# EAGLE board Nixie Clock v2 (EAGLE 9.6.2)
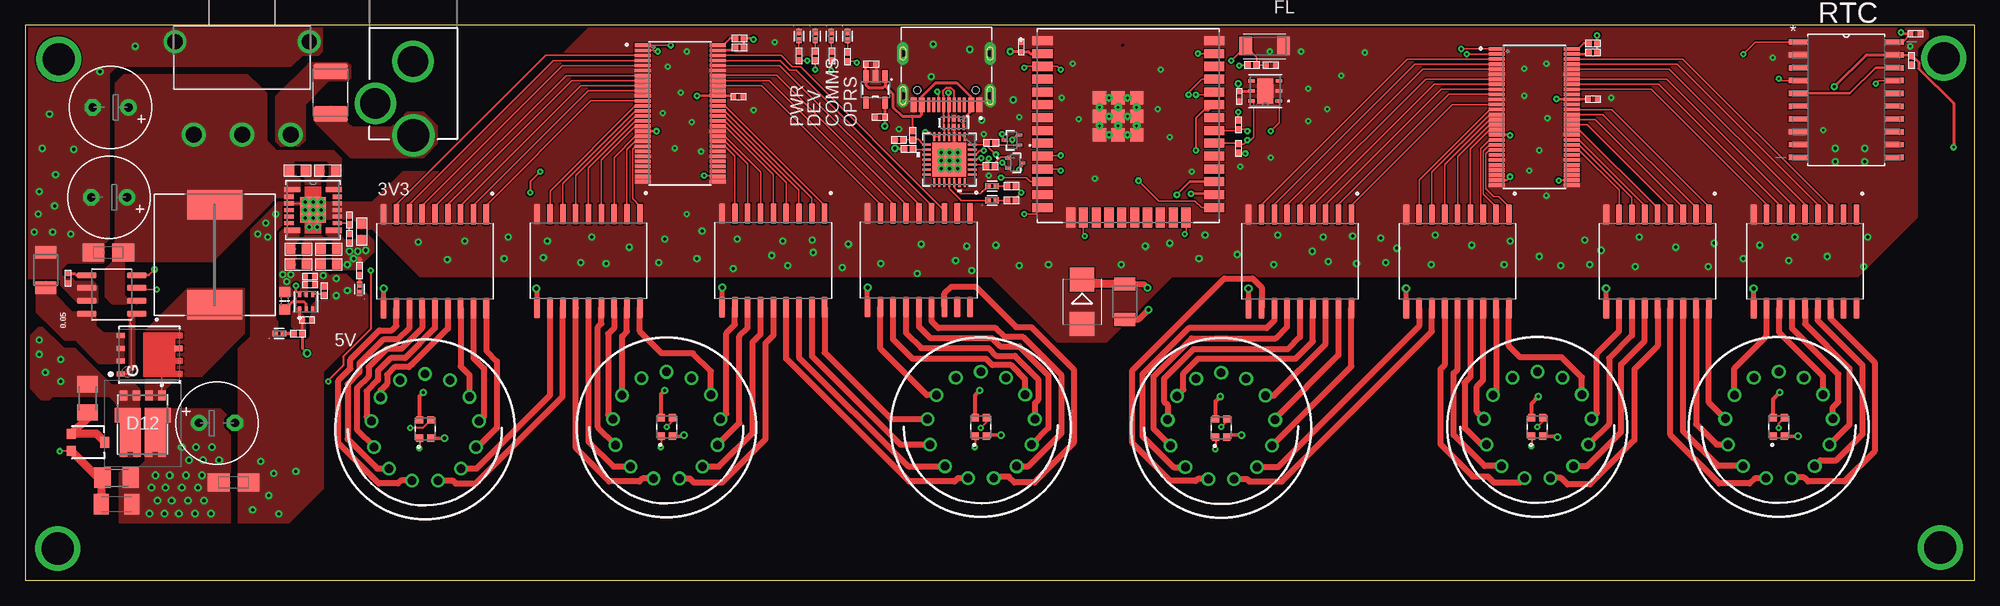
[diagram p2: board, top side]
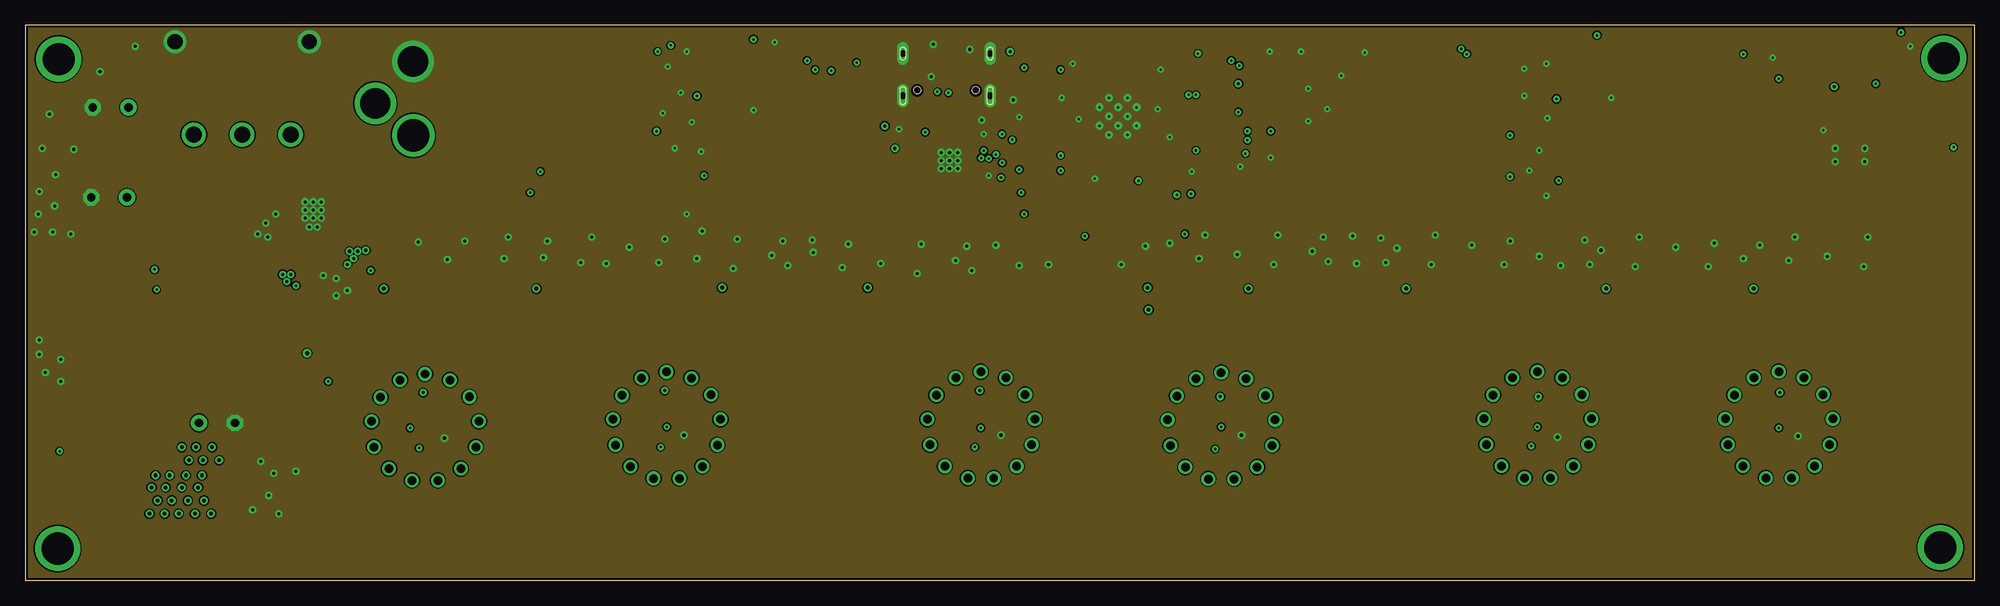
[diagram p3: board, inner layer Route2]
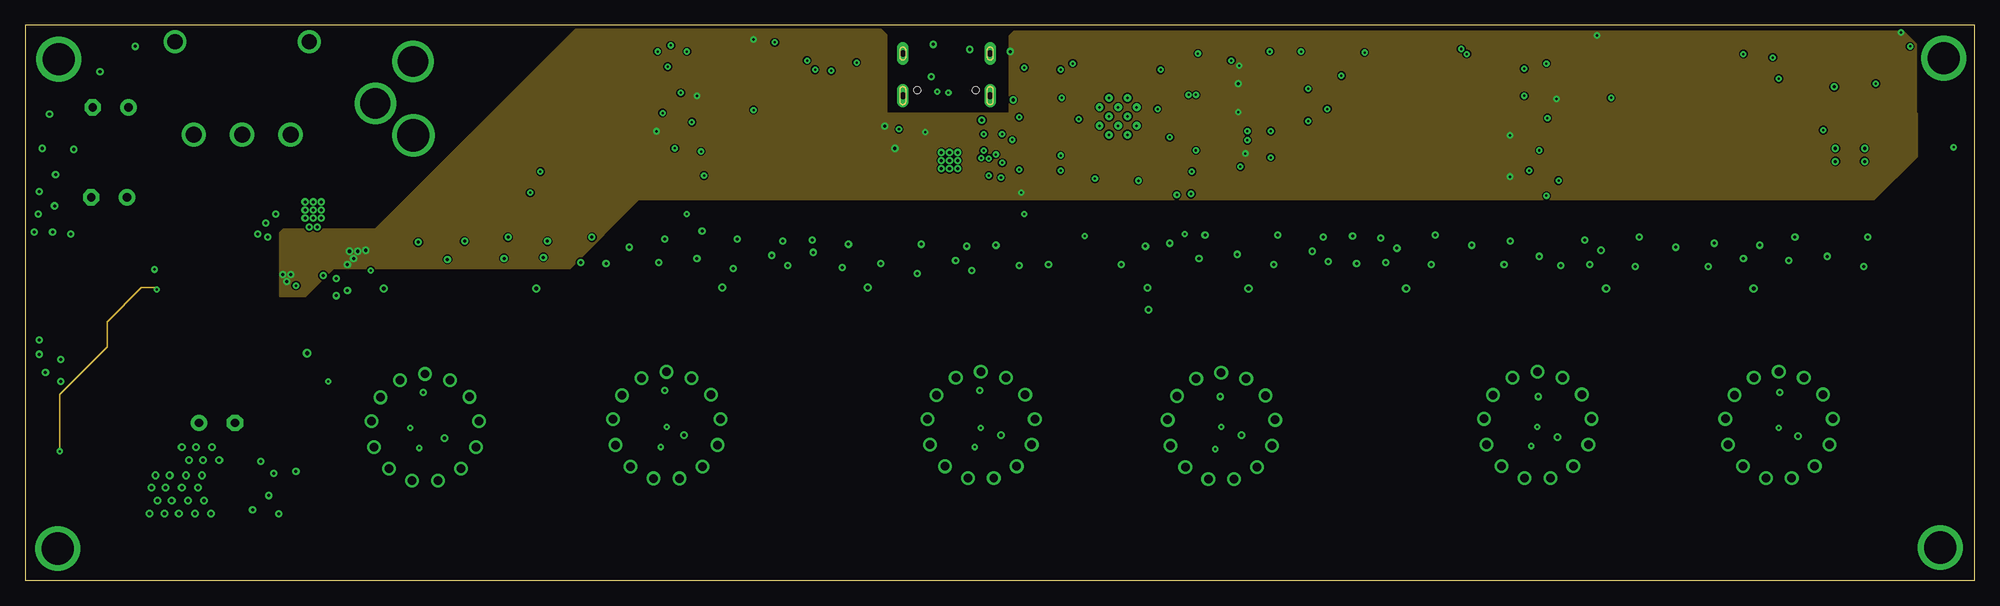
[diagram p4: board, inner layer Route15]
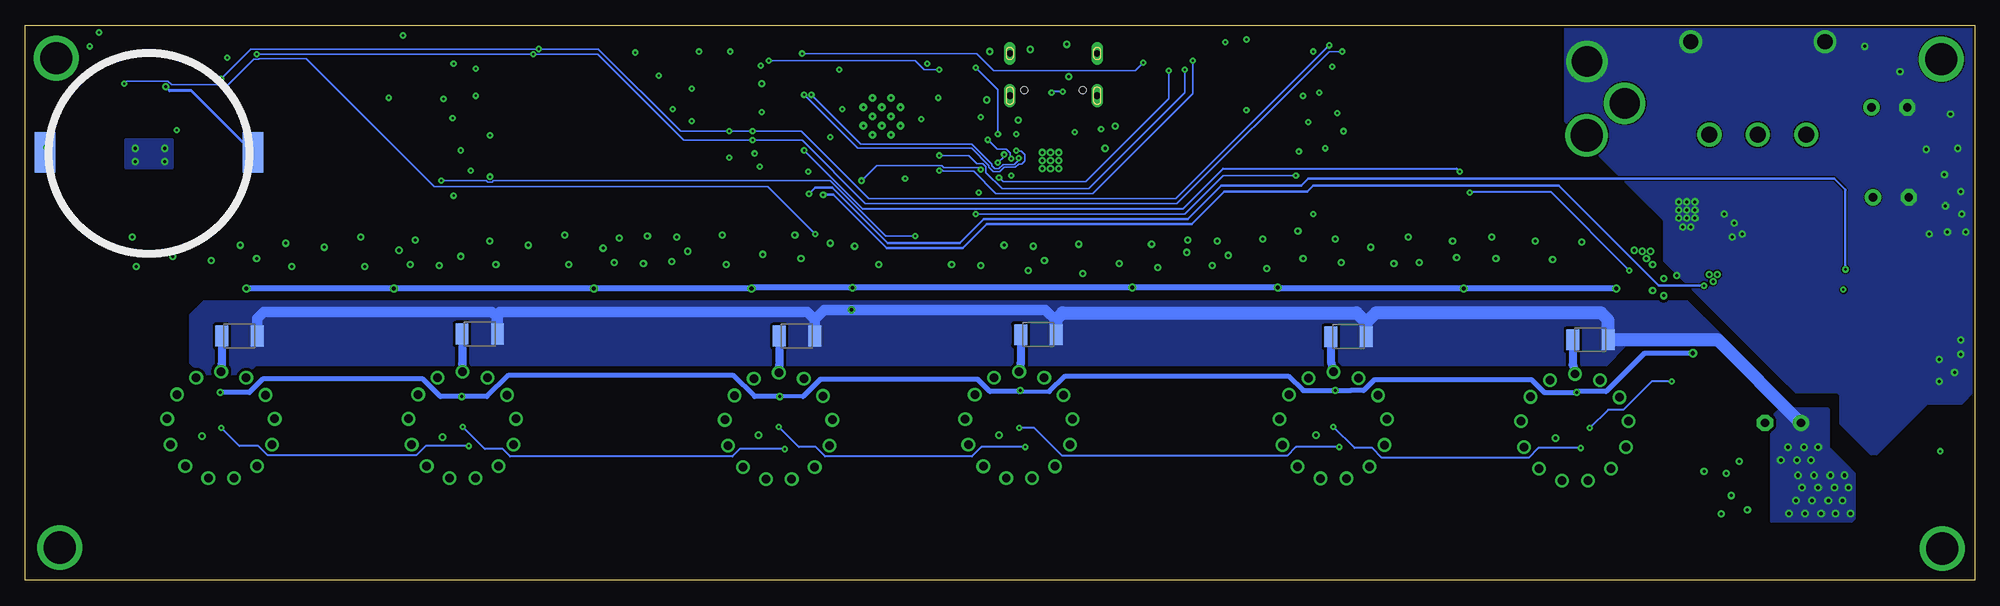
[diagram p5: board, bottom side, seen from below]

Size 193 x 55 mm. Coordinates in mm from the lower left corner, seen from the top.
Outline: 0,0 193,0 193,55 0,55 0,0
Copper layers (1+2*15+16): Top 0.035mm / dielectric 1.11mm / Route2 0.035mm / dielectric 0.15mm / Route15 0.035mm / dielectric 0.2mm / Bottom 0.035mm
Design rules "default *": minimum track width 5mil, minimum drill 0.2mm, track to track 5mil, track to pad 5mil, pad to pad 5mil, via to via 5mil, smd to smd 5mil, copper to edge 10mil, drill to drill 6mil, minimum pad ring 10mil, minimum via ring 8mil, stop-mask expansion 0mil, vias tented up to drill 40mil, thermal gap 0mil
Net classes: 1 HV: width 0.35 mm, drill 0.35 mm, clearance 0.3 mm
tRestrict: 2 lines

## Footprints (pad centres in the part's own frame; a part is rotated, then mirrored left to right if it is on the bottom)
R0402 = smd 0.6 x 0.55: 1 -0.425,0; 2 0.425,0
1210 = smd 1.27 x 2.06: 1 -1.755,0; 2 1.755,0
E3,5-8 = drill 0.813 pad 1.6: + -1.778,0 | drill 0.813 pad 1.6 octagon: - 1.778,0
A/3216-18W = smd 2.15 x 1.8: + 1.475,0; - -1.475,0
C0402 = smd 0.5 x 0.5: 1 -0.475,0; 2 0.475,0
C1206K = smd 1.5 x 2: 1 -1.5,0; 2 1.5,0
C0603R = smd 0.95 x 0.95: 1 -0.85,0; 2 0.75,0
DIODE_SMB = smd 2.4 x 2.4: A 2.2,0; C -2.2,0
LEDC1005X35N = smd 0.59 x 0.61: 1 -0.415,0; 2 0.415,0
VS8DKH02M3H = smd 0.75 x 1: 1 -1.905,-2.905; 2 -0.635,-2.905; 3 0.635,-2.905; 4 1.905,-2.905 | smd 0.75 x 0.56: 5 1.905,2.905; 6 0.575,2.905; 7 -0.575,2.905; 8 -1.905,2.905 | smd 2.08 x 2.88: 9 -1.24,1.195; 10 1.24,1.195 | smd 2.575 x 1.4: 11 1.487,-0.935; 12 -1.487,-0.935
1812 = smd 1.58 x 3.43: 1 -2.1,0; 2 2.1,0
HRO_TYPE-C-31-M-12 = smd 0.6 x 1.45: A1B12 -3.25,5.095; A4B9 -2.45,5.095; B1A12 3.25,5.095; B4A9 2.45,5.095 | smd 0.3 x 1.45: A5 -1.25,5.095; A6 -0.25,5.095; A7 0.25,5.095; A8 1.25,5.095; B5 1.75,5.095; B6 0.75,5.095; B7 -0.75,5.095; B8 -1.75,5.095 | drill 0.65 pad 1.05 long: S1 -4.32,4.18; S2 4.32,4.18; S3 -4.32,0; S4 4.32,0 | hole 0.7: -2.89,3.65; 2.89,3.65
POWER_JACK_PTH_LOCK = drill 2.997 pad 4.115: GND 0.025,6.557; GNDBREAK 3.762,10.7 | drill 3.2 pad 4.115: PWR 0,13.878
WE-PD_1260/1245/1280/1210 = smd 2.9 x 5.4: 1 -4.95,0; 2 4.95,0
L0603 = smd 1 x 1.1: 1 -0.85,0; 2 0.85,0
BEAGLEBONEBLACK_MOUNTING_HOLE = drill 3.175 pad 4.445: P$1 0,0
IN-14 = drill 0.84: 0 4.394,-3.166; 1 -4.394,-3.216; 2 -5.345,-0.796; 3 -5.038,1.745; 4 -3.555,3.883; 5 -1.281,5.06; 6 1.281,5.06; 7 3.555,3.883; 8 5.038,1.745; 9 5.295,-0.796; A 0,-5.49; LHDP 2.477,-4.881; RHDP -2.477,-4.881
INF-PG-TSON-8-2 = smd 0.5 x 0.8: 1 -1.905,2.85; 2 -0.635,2.85; 3 0.635,2.85; 4 1.905,2.85 | smd 0.5 x 0.75: 5 0.635,-2.85
M1206 = smd 1.6 x 2: 1 -1.4,0; 2 1.4,0
RESC4217X170 = smd 1.254 x 1.829: 1 -1.875,0; 2 1.875,0
SS12D11L5 = drill 1.6 pad 2.4: 1 0,0; 2 4.8,0; 3 9.6,0 | drill 1.5 pad 2.25: MH1 -1.85,9.2; MH2 11.45,9.2
SOP50P810X120-56N = smd 1.59 x 0.29: 1 -3.715,6.75; 2 -3.715,6.25; 3 -3.715,5.75; 4 -3.715,5.25; 5 -3.715,4.75; 6 -3.715,4.25; 7 -3.715,3.75; 8 -3.715,3.25; 9 -3.715,2.75; 10 -3.715,2.25; 11 -3.715,1.75; 12 -3.715,1.25; 13 -3.715,0.75; 14 -3.715,0.25; 15 -3.715,-0.25; 16 -3.715,-0.75; 17 -3.715,-1.25; 18 -3.715,-1.75; 19 -3.715,-2.25; 20 -3.715,-2.75; 21 -3.715,-3.25; 22 -3.715,-3.75; 23 -3.715,-4.25; 24 -3.715,-4.75; 25 -3.715,-5.25; 26 -3.715,-5.75; 27 -3.715,-6.25; 28 -3.715,-6.75; 29 3.715,-6.75; 30 3.715,-6.25; 31 3.715,-5.75; 32 3.715,-5.25; 33 3.715,-4.75; 34 3.715,-4.25; 35 3.715,-3.75; 36 3.715,-3.25; 37 3.715,-2.75; 38 3.715,-2.25; 39 3.715,-1.75; 40 3.715,-1.25; 41 3.715,-0.75; 42 3.715,-0.25; 43 3.715,0.25; 44 3.715,0.75; 45 3.715,1.25; 46 3.715,1.75; 47 3.715,2.25; 48 3.715,2.75; 49 3.715,3.25; 50 3.715,3.75; 51 3.715,4.25; 52 3.715,4.75; 53 3.715,5.25; 54 3.715,5.75; 55 3.715,6.25; 56 3.715,6.75
SOT23-5 = smd 0.55 x 1.2: 1 -0.95,-1.3; 2 0,-1.3; 3 0.95,-1.3; 4 0.95,1.3; 5 -0.95,1.3
SOIC127P1030X265-18N = smd 2.06 x 0.6: 1 -4.64,5.08; 2 -4.64,3.81; 3 -4.64,2.54; 4 -4.64,1.27; 5 -4.64,0; 6 -4.64,-1.27; 7 -4.64,-2.54; 8 -4.64,-3.81; 9 -4.64,-5.08; 10 4.64,-5.08; 11 4.64,-3.81; 12 4.64,-2.54; 13 4.64,-1.27; 14 4.64,0; 15 4.64,1.27; 16 4.64,2.54; 17 4.64,3.81; 18 4.64,5.08
PSON65P200X200X80-6N = smd 0.55 x 0.4: 1 -0.75,0.65; 2 -0.75,0; 3 -0.75,-0.65; 4 0.75,-0.65; 5 0.75,0; 6 0.75,0.65
SC-75_ONS-L = smd 0.305 x 0.61: 1 -0.5,-0.699; 2 0.5,-0.699; 3 0,0.699
QFN28_5X5_SIL-L = smd 0.864 x 0.203: 1 -2.273,1.5; 2 -2.273,1; 3 -2.273,0.5; 4 -2.273,0; 5 -2.273,-0.5; 6 -2.273,-1; 7 -2.273,-1.5; 15 2.273,-1.5; 16 2.273,-1; 17 2.273,-0.5; 18 2.273,0; 19 2.273,0.5; 20 2.273,1; 21 2.273,1.5 | smd 0.203 x 0.864: 8 -1.5,-2.273; 9 -1,-2.273; 10 -0.5,-2.273; 11 0,-2.273; 12 0.5,-2.273; 13 1,-2.273; 14 1.5,-2.273; 22 1.5,2.273; 23 1,2.273; 24 0.5,2.273; 25 0,2.273; 26 -0.5,2.273; 27 -1,2.273; 28 -1.5,2.273 | smd 3.353 x 3.353: 29 0,0
DFN6_3X3_SIL-L = smd 0.66 x 0.356: 1 -1.372,0.991; 2 -1.372,0; 3 -1.372,-0.991; 4 1.372,-0.991; 5 1.372,0; 6 1.372,0.991 | smd 1.6 x 2.489: 7 0,0
DQA0010A = smd 0.565 x 0.2: 1 -0.417,1; 2 -0.417,0.5; 4 -0.417,-0.5; 5 -0.417,-1; 6 0.417,-1; 7 0.417,-0.5; 9 0.417,0.5; 10 0.417,1 | smd 0.565 x 0.4: 3 -0.417,0; 8 0.417,0
SOIC127P600X175-8N = smd 1.97 x 0.59: 1 -2.475,1.905; 2 -2.475,0.635; 3 -2.475,-0.635; 4 -2.475,-1.905; 5 2.475,-1.905; 6 2.475,-0.635; 7 2.475,0.635; 8 2.475,1.905
B3QFN15_RDA_TEX = smd 1.6 x 0.508: 1 -2.057,2.025; 7 -2.057,-2.025; 8 2.057,-2.025; 14 2.057,2.025 | smd 0.914 x 0.406: 2 -2.4,1.3; 3 -2.4,0.65; 4 -2.4,0; 5 -2.4,-0.65; 6 -2.4,-1.3; 9 2.4,-1.3; 10 2.4,-0.65; 11 2.4,0; 12 2.4,0.65; 13 2.4,1.3 | smd 2.54 x 2.54: 15 0,0
LED_WS2812C-2020 = smd 0.7 x 0.7: 1 -0.915,0.55; 2 -0.915,-0.55; 3 0.915,-0.55; 4 0.915,0.55
XCVR_ESP32-WROOM-32U = smd 2 x 0.9: 1 -8.5,8.41; 2 -8.5,7.14; 3 -8.5,5.87; 4 -8.5,4.6; 5 -8.5,3.33; 6 -8.5,2.06; 7 -8.5,0.79; 8 -8.5,-0.48; 9 -8.5,-1.75; 10 -8.5,-3.02; 11 -8.5,-4.29; 12 -8.5,-5.56; 13 -8.5,-6.83; 14 -8.5,-8.1; 25 8.5,-8.1; 26 8.5,-6.83; 27 8.5,-5.56; 28 8.5,-4.29; 29 8.5,-3.02; 30 8.5,-1.75; 31 8.5,-0.48; 32 8.5,0.79; 33 8.5,2.06; 34 8.5,3.33; 35 8.5,4.6; 36 8.5,5.87; 37 8.5,7.14; 38 8.5,8.41 | smd 0.9 x 2: 15 -5.715,-9.1; 16 -4.445,-9.1; 17 -3.175,-9.1; 18 -1.905,-9.1; 19 -0.635,-9.1; 20 0.635,-9.1; 21 1.905,-9.1; 22 3.175,-9.1; 23 4.445,-9.1; 24 5.715,-9.1 | smd 1.33 x 1.33: G.1 0.835,2.745; G.2 -1,2.745; G.4 -2.835,2.745; G.5 0.835,0.91; G.6 -1,0.91; G.7 -2.835,0.91; G.8 0.835,-0.925; G.9 -1,-0.925; G.10 -2.835,-0.925 | drill 0.254: G.11 -0.083,2.745; G.12 -1.917,2.745; G.13 0.835,1.827; G.14 -1,1.827; G.15 -2.835,1.827; G.16 -0.083,0.91; G.17 -1.917,0.91; G.18 0.835,-0.007; G.19 -1,-0.007; G.20 -2.835,-0.007; G.21 -0.083,-0.925; G.22 -1.917,-0.925
PCF2129AT = smd 1.803 x 0.533: 1 -4.775,5.715; 2 -4.775,4.445; 3 -4.775,3.175; 4 -4.775,1.905; 5 -4.775,0.635; 6 -4.775,-0.635; 7 -4.775,-1.905; 8 -4.775,-3.175; 9 -4.775,-4.445; 10 -4.775,-5.715; 11 4.775,-5.715; 12 4.775,-4.445; 13 4.775,-3.175; 14 4.775,-1.905; 15 4.775,-0.635; 16 4.775,0.635; 17 4.775,1.905; 18 4.775,3.175; 19 4.775,4.445; 20 4.775,5.715
HOLDER = smd 2 x 4: P$1 10.3,-0.1; P$2 -10.3,-0.1
TRIMPOT-SMD-3MM-CLOSED = smd 1 x 0.9: 1 -0.85,-1.65; 3 0.85,-1.65 | smd 1.1 x 0.9: 2 0,1.65

## Placement (x,y rotation side)
0  inf  [R0402]  29.6,28.7 270 top
0.05  0.05  [1210]  2.04,30.75 270 top
20K  0.05  [1210]  92.7,24.34 0 bottom
20K1  0.05  [1210]  38.05,23.84 0 bottom
20K2  0.05  [1210]  62,24.14 0 bottom
20K3  0.05  [1210]  171.8,24.2 0 bottom
20K4  0.05  [1210]  116.6,24.2 0 bottom
20K5  0.05  [1210]  148,24.4 0 bottom
40K  0.05  [1210]  108.86,27.6 90 top
C1  100u  [E3,5-8]  8.3,37.95 180 top
C2  100u  [E3,5-8]  8.45,46.86 180 top
C3  4.7u  [E3,5-8]  18.98,15.59 0 top
C4  100n  [A/3216-18W]  20.63,9.71 180 top
C5  100n  [C0402]  4.23,29.92 270 top
C6  100n  [A/3216-18W]  8.22,32.49 0 top
C7  100n  [C1206K]  9.03,7.56 180 top
C8  100nF  [C0402]  70.6,47.9 0 top
C11  100nF  [C0402]  155.2,47.68 0 top
C12  22u  [C0603R]  27,40.6 0 top
C13  22u  [C0603R]  29.9,40.6 180 top
C15  22u  [C0603R]  27.1,31.3 0 top
C17  0.1u  [C0402]  28.2,29.3 180 top
C18  10u  [C0402]  28.2,30.1 180 top
C20  10u  [C0402]  27.9,25.8 180 top
C25  100nF  [C0402]  123.31,51.04 0 top
C30  100nF  [C0402]  98.61,52.86 90 top
C31  100nF  [C0402]  120.2,47.95 270 top
C32  100nF  [C0402]  84.6,45.9 180 top
C33  100nF  [C0402]  83.75,51.15 0 top
C34  100nF  [C0402]  187.15,54.15 0 top
C35  22u  [C0603R]  30,31.3 180 top
C36  22u  [C0603R]  27.1,32.8 0 top
C37  22u  [C0603R]  30,32.8 180 top
C39  22u  [C0603R]  33.3,34.6 90 top
D1  [DIODE_SMB]  104.62,27.61 270 top
D2  VLMG1500-GS08  [LEDC1005X35N]  76.6,53.92 90 top
D3  VLMG1500-GS08  [LEDC1005X35N]  78.2,53.92 90 top
D4  VLMG1500-GS08  [LEDC1005X35N]  33.1,28.88 270 top
D5  VLMG1500-GS08  [LEDC1005X35N]  25.15,24.45 180 top
D6  VLMG1500-GS08  [LEDC1005X35N]  79.8,53.92 90 top
D7  VLMG1500-GS08  [LEDC1005X35N]  81.4,53.92 90 top
D10  VLMG1500-GS08  [LEDC1005X35N]  95.73,39.05 180 top
D11  VLMG1500-GS08  [LEDC1005X35N]  95.73,37.65 180 top
D12  VS-8DKH02-M3_H  [VS8DKH02M3H]  11.63,15.43 180 top
F1  MF-MSMF050-2  [1812]  30.23,48.32 90 top
J1  TYPE-C-31-M-12  [HRO_TYPE-C-31-M-12]  91.2,52.2 180 top
J2  POWER_JACKPTH_LOCK  [POWER_JACK_PTH_LOCK]  38.42,57.96 180 top
L1  100u  [WE-PD_1260/1245/1280/1210]  18.76,32.25 270 top
L4  2.2u  [L0603]  25.7,27.7 270 top
MGT1  BEAGLEBONEBLACK_MOUNTING_HOLE  [BEAGLEBONEBLACK_MOUNTING_HOLE]  3.2,3.15 0 top
MGT2  BEAGLEBONEBLACK_MOUNTING_HOLE  [BEAGLEBONEBLACK_MOUNTING_HOLE]  189.6,3.25 0 top
MGT3  BEAGLEBONEBLACK_MOUNTING_HOLE  [BEAGLEBONEBLACK_MOUNTING_HOLE]  3.3,51.65 0 top
MGT4  BEAGLEBONEBLACK_MOUNTING_HOLE  [BEAGLEBONEBLACK_MOUNTING_HOLE]  189.95,51.75 0 top
N1  IN-14  [IN-14]  39.57,14.96 180 top
N2  IN-14  [IN-14]  63.48,15.16 180 top
N3  IN-14  [IN-14]  94.6,15.18 180 top
N4  IN-14  [IN-14]  118.4,15.1 180 top
N5  IN-14  [IN-14]  149.7,15.2 180 top
N6  IN-14  [IN-14]  173.6,15.2 180 top
Q1  IPL60R650P6S  [INF-PG-TSON-8-2]  12.3,22.35 90 top
R1  4.7k  [R0402]  70.7,53.7 0 top
R2  4.7k  [R0402]  120.11,45.13 90 top
R3  4.7k  [R0402]  120.09,42.81 270 top
R4  4.7k  [R0402]  155.2,52.3 180 top
R5  1.5k  [R0402]  78.21,51.96 90 top
R6  1.5k  [R0402]  76.61,51.97 90 top
R7  1.5k  [R0402]  81.41,51.88 90 top
R8  4.7k  [R0402]  155.2,53.2 0 top
R9  10k  [R0402]  95.55,41.04 0 top
R10  1.5k  [R0402]  33.09,30.69 270 top
R11  1.5k  [R0402]  97.63,39.06 180 top
R12  4.7k  [R0402]  70.7,52.8 180 top
R13  1.5k  [R0402]  79.86,51.94 90 top
R14  10k  [R0402]  32.1,33.9 270 top
R15  10k  [R0402]  121.45,51.06 180 top
R16  4.32k  [R0402]  32.1,35.7 90 top
R17  47.5k  [R0402]  86.51,43.64 0 top
R19  10k  [M1206]  6.17,18.04 270 top
R20  10k  [R0402]  95.63,43.34 0 top
R21  22.1k  [R0402]  87.86,44.09 90 top
R22  1k  [R0402]  87.45,42.74 0 top
R23  1.5k  [R0402]  97.64,37.66 180 top
R24  1.5M  [M1206]  9.04,10.17 0 top
R31  1.5k  [R0402]  27,24.45 180 top
R32  0  [R0402]  186.75,51.5 270 top
RESET  SMDSWITCH  [RESC4217X170]  122.7,52.93 180 top
S1  SS-12D11L5  [SS12D11L5]  16.67,44.16 0 top
U1  PCA9698DGG,518  [SOP50P810X120-56N]  64.83,46.26 0 top
U2  PCA9698DGG,518  [SOP50P810X120-56N]  149.4,45.9 0 top
U3  3.3V  [SOT23-5]  84.17,48.63 180 top
U4  ULN2803ADWR  [SOIC127P1030X265-18N]  161.6,31.6 270 top
U5  MAX17223ELT+T  [PSON65P200X200X80-6N]  27.8,27.6 90 top
U6  ULN2803ADWR  [SOIC127P1030X265-18N]  176.2,31.6 270 top
U7  DTC114YET1GSC-75_ONS-L  [SC-75_ONS-L]  98.02,41.35 270 top
U9  CP2102N-A02-GQFN28QFN28_5X5_SIL-L  [QFN28_5X5_SIL-L]  91.49,41.69 270 top
U10  SI7021-A20-GM1RDFN6_3X3_SIL-L  [DFN6_3X3_SIL-L]  122.76,48.48 180 top
U11  DTC114YET1GSC-75_ONS-L  [SC-75_ONS-L]  97.68,43.61 90 top
U12  Value  [DQA0010A]  91.92,45.32 270 top
U13  ULN2803ADWR  [SOIC127P1030X265-18N]  74.06,31.69 270 top
U14  ULN2803ADWR  [SOIC127P1030X265-18N]  88.46,31.73 270 top
U16  ULN2803ADWR  [SOIC127P1030X265-18N]  126.2,31.6 270 top
U17  ULN2803ADWR  [SOIC127P1030X265-18N]  40.56,31.61 270 top
U18  ULN2803ADWR  [SOIC127P1030X265-18N]  55.76,31.65 270 top
U19  ULN2803ADWR  [SOIC127P1030X265-18N]  141.8,31.6 270 top
U20  MAX1771CSA+  [SOIC127P600X175-8N]  8.56,28.33 180 top
U25  TPSM53602RDAR  [B3QFN15_RDA_TEX]  28.5,36.7 0 top
U26  WS2812C-2020  [LED_WS2812C-2020]  39.6,15 90 top
U27  WS2812C-2020  [LED_WS2812C-2020]  63.5,15.2 90 top
U28  ESP32-WROOM-32U  [XCVR_ESP32-WROOM-32U]  109.2,45.05 0 top
U29  WS2812C-2020  [LED_WS2812C-2020]  94.6,15.2 90 top
U30  WS2812C-2020  [LED_WS2812C-2020]  118.4,15.1 90 top
U31  WS2812C-2020  [LED_WS2812C-2020]  149.7,15.2 90 top
U32  WS2812C-2020  [LED_WS2812C-2020]  173.6,15.2 90 top
U$1  [PCF2129AT]  180.28,47.61 0 top
U$2  HOLDER  [HOLDER]  180.75,42.3 180 bottom
VR1  5k  [TRIMPOT-SMD-3MM-CLOSED]  6.22,13.66 270 top

## Tracks (layer width: path | path; a pad name or v marks a point on that pad's centre or on a via)
01
  Top 0.127: U1.8 54.1,49.51 41.83,37.23 U17.4
02
  Top 0.127: U1.20 60.41,43.51 59.57,42.67 U18.2
03
  Top 0.127: U14.8 84.65,37.26 72.9,49.01 U1.48
04
  Top 0.127: U2.8 139.5,49.15 127.47,37.12 U16.4
05
  Top 0.127: U2.20 144.98,43.15 144.35,42.51 144.35,38.25 145.61,36.99 U19.2
5V  (via drill 0.3, 0.4)
  Top 0.254: 27.43,25.5 27.43,24.4 | R31.1 27.43,22.98 v27.9,22.5
  Top 0.305: U5.1 27.15,26.07 C20.2 27.43,25.5 | 27.43,24.4 27.43,22.98
  Top 0.406: U26.4 39.05,18.25 v39.4,18.6 | U27.4 62.95,18.45 v63.3,18.8 | U29.4 94.05,18.35 v94.5,18.8 | U30.4 117.85,17.75 v118.3,18.2 | U31.4 149.15,17.55 v149.8,18.2 | U32.4 173.05,17.95 v173.7,18.6
  Bottom 0.305: v63.3,18.8 61.8,18.8
  Bottom 0.406: v94.5,18.8 94.4,18.7 91.6,18.7 | 116,18.2 v118.3,18.2 | 151.9,18.2 v149.8,18.2 147.3,18.2
  Bottom 0.508: v27.9,22.5 32.7,22.5 36.5,18.7 39.3,18.7 v39.4,18.6 42.6,18.6 43.9,19.9 59.4,19.9 60.5,18.8 61.8,18.8 66.5,18.8 67.9,20.2 90.1,20.2 91.6,18.7 | v94.5,18.8 94.6,18.7 97.5,18.7 98.72,19.92 114.28,19.92 116,18.2 | v118.3,18.2 120.8,18.2 122.9,20.3 145.2,20.3 147.3,18.2 151.9,18.2 153.64,19.94 169.47,19.94 170.81,18.6 v173.7,18.6
  pour Top: 27.7,24.2 27.7,26 27.5,26.2 27.3,26.4 27.3,27 26.9,27 26.5,26.6 26.5,26.5 26.4,26.4 26.4,25.2 26.6,25 26.9,25 27.2,24.7 27.2,24.2
06
  Top 0.127: U6.8 172.39,37.23 160.97,48.65 U2.48
11
  Top 0.127: U1.9 54.98,49.01 43.1,37.13 U17.3
12
  Top 0.127: U1.21 60.41,43.01 60.13,42.73 60.13,37.8 60.84,37.09 U18.1
13
  Top 0.127: U14.7 85.92,37.26 73.66,49.51 U1.49
14
  Top 0.127: U2.9 140.17,48.65 128.74,37.23 U16.3
15
  Top 0.127: 146.39,42.65 U2.21 144.95,42.65 144.6,42.3 144.6,38.8 145.4,38 145.9,38 146.88,37.02 U19.1
16
  Top 0.127: U6.7 173.66,37.23 161.74,49.15 U2.49
21
  Top 0.127: U1.10 55.74,48.51 44.37,37.13 U17.2
22
  Top 0.127: U1.36 69.25,43.01 70.25,42.01 U13.8
23
  Top 0.127: U14.6 87.19,37.26 74.4,50.05 68.58,50.05 U1.50
24
  Top 0.127: U2.10 140.94,48.15 130.01,37.23 U16.2
25
  Top 0.127: U2.36 153.82,42.65 157.79,38.68 U4.8
26
  Top 0.127: U6.6 174.93,37.23 162.5,49.65 U2.50
31
  Top 0.127: U1.12 56,47.51 45.64,37.15 U17.1
32
  Top 0.127: U1.37 69.25,43.51 71.52,41.24 U13.7
33
  Top 0.127: U14.5 88.46,37.26 74.7,51.01 U1.52
34
  Top 0.127: U2.12 141.29,47.15 131.28,37.14 U16.1
35
  Top 0.127: U4.7 159.06,37.91 153.82,43.15 U2.37
36
  Top 0.127: U6.5 176.2,37.23 162.78,50.65 U2.52
41
  Top 0.127: U1.13 60.41,47.01 51.95,38.55 U18.8
42
  Top 0.127: U1.38 69.25,44.01 72.79,40.47 U13.6
43
  Top 0.127: U14.4 89.73,37.16 76.34,50.55 75.7,50.55 74.73,51.51 U1.53
44
  Top 0.127: U2.13 144.98,46.65 137.99,39.66 U19.8
45
  Top 0.127: U2.38 153.82,43.65 160.33,37.14 U4.6
46
  Top 0.127: U6.4 177.47,37.23 163.54,51.15 U2.53
51
  Top 0.127: U1.14 60.41,46.51 53.22,39.32 U18.7
52
  Top 0.127: U1.40 69.25,45.01 74.06,40.2 U13.5
53
  Top 0.127: U14.3 91,36.66 76.76,50.9 75.95,50.9 74.83,52.01 U1.54
54
  Top 0.127: U2.14 144.98,46.15 139.26,40.43 U19.7
55
  Top 0.127: U4.5 161.6,36.87 153.82,44.65 U2.40
56
  Top 0.127: U6.3 178.74,37.02 164.12,51.65 U2.54
61
  Top 0.127: U1.3 51.52,52.01 36.75,37.23 U17.8
62
  Top 0.127: U1.15 60.41,46.01 54.49,40.09 U18.6
63
  Top 0.127: U13.4 75.33,39.43 69.25,45.51 U1.41
64
  Top 0.127: U2.3 136.81,51.65 122.39,37.23 U16.8
65
  Top 0.127: U2.15 144.98,45.65 140.53,41.2 U19.6
66
  Top 0.127: U4.4 162.87,36.92 154.65,45.15 U2.41
71
  Top 0.127: U1.4 52.3,51.51 38.02,37.23 U17.7
72
  Top 0.127: U1.16 60.41,45.51 55.76,40.86 U18.5
73
  Top 0.127: U1.42 69.25,46.01 76.6,38.66 U13.3
74
  Top 0.127: U2.4 137.58,51.15 123.66,37.23 U16.7
75
  Top 0.127: U2.16 144.98,45.15 141.8,41.97 U19.5
76
  Top 0.127: U4.3 164.14,36.92 155.41,45.65 U2.42
81
  Top 0.127: U1.5 53.16,51.01 39.29,37.13 U17.6
82
  Top 0.127: U1.17 60.41,45.01 57.03,41.63 U18.4
83
  Top 0.127: U13.2 77.87,37.89 69.25,46.51 U1.43
84
  Top 0.127: U2.5 138.36,50.65 124.93,37.23 U16.6
85
  Top 0.127: U2.17 144.98,44.65 143.07,42.74 U19.4
86
  Top 0.127: U4.2 165.41,36.92 156.19,46.15 U2.43
91
  Top 0.127: U1.7 53.53,50.01 40.56,37.03 U17.5
92
  Top 0.127: U1.19 60.41,44.01 58.3,41.9 U18.3
93
  Top 0.127: U13.1 79.14,37.12 69.25,47.01 U1.44
94
  Top 0.127: U2.7 138.62,49.65 126.2,37.23 U16.5
95
  Top 0.127: U2.19 144.98,43.65 144.09,42.76 144.09,36.49 U19.3
96
  Top 0.127: U4.1 166.68,37.02 157.06,46.65 U2.44
170V  (via drill 0.35)
  Top 0.61: 40K.1 110.25,25.84 v111.2,26.8
  Bottom 1.016: 20K.2 90.94,25.75 92,26.8 v111.2,26.8 113.9,26.8 114.84,25.86 20K4.2 114.84,25.84 115.6,26.6 146,26.6 146.3,26.3 146.3,24.45 20K5.2 146.25,26.05 146.8,26.6 169.4,26.6 170.04,25.95 20K3.2
  Bottom 1.27: C3.+ 25.45,23.84 20K1.2 36.3,25.8 37,26.5 59.3,26.5 60.24,25.55 | 20K2.2 60.24,25.55 | 60.24,25.55 61.19,26.5 90.3,26.5 90.94,25.86 20K.2
  other vias: 17.5,10.4 15.9,10.4 14.3,10.4 12.9,10.4 18.4,6.6 16.8,6.6 15.2,6.6 13.8,6.6 12.3,6.6 17.7,7.9 16.1,7.9 14.5,7.9 13.1,7.9 17.1,9.2 15.5,9.2 13.9,9.2 12.5,9.2 19.2,11.9 17.6,11.9 16.2,11.9 18.5,13.2 16.9,13.2 15.5,13.2
  pour Top: 11.9,17 19.3,17 20.3,16 20.3,5.7 9.3,5.7 9.3,10.6 9.7,11 11.1,11 11.9,11.8
  pour Bottom: 11.9,6.1 11.9,10.6 14.4,13.1 14.4,16.9 14.6,17.1 19.2,17.1 20.2,16.1 20.2,5.8 12.2,5.8
  pour Bottom: 25.3,24.5 28.5,27.7 40.3,27.7 175.3,27.7 176.7,26.3 176.7,21.6 175.5,20.4 171.1,20.4 170.2,21.3 36.5,21.3 34.6,23.2 25.6,23.2 25,23.8 25,24.2
BOOT  (via drill 0.2, 0.25)
  Top 0.15: U28.25 116.45,36.95 115.8,37.6 112.2,37.6 v110.2,39.6 | v98.4,40.7 98.72,41.02 U7.3
  Bottom 0.15: v110.2,39.6 108.69,41.1 102.29,41.1 102.09,40.9 98.6,40.9 v98.4,40.7
COMLED  (via drill 0.2)
  Top 0.15: R13.1 79.86,50.56 v79.8,50.5 | v96.6,39.9 99.1,39.9 99.51,39.49 U28.12
  Bottom 0.15: v79.8,50.5 79.8,47.7 88,39.5 96.2,39.5 v96.6,39.9
D+  (via drill 0.2)
  Top 0.2: U9.4 91.42,44.03 U12.7 U12.4 91.42,47.08 J1.A6 91.45,48.25 v91.4,48.3 | J1.B6 90.45,48.25 v90.3,48.4
  Bottom 0.2: v90.3,48.4 91.3,48.4 v91.4,48.3
D-
  Top 0.2: U9.5 90.99,44.83 U12.6 U12.5 90.92,47.08 J1.A7 90.95,48 90.87,48.08 90.87,48.52 91.18,48.83 91.62,48.83 91.93,48.52 91.93,47.12 J1.B7
DEVLED  (via drill 0.2)
  Top 0.15: R5.1 v78.21,50.61 v78.2,50.6 | v102.5,42.1 100.77,42.1 U28.10
  Bottom 0.15: v78.2,50.6 78.2,48.3 87.7,38.8 96.3,38.8 97.89,40.4 97.89,41.01 98.19,41.3 98.81,41.3 99.6,42.1 v102.5,42.1
DTR  (via drill 0.2)
  Top 0.15: U9.28 95.06,43.19 R20.1 95.2,43.09 v96.1,42.2 | U7.2 97.25,40.85 v96.72,41.38
  Bottom 0.15: v96.72,41.38 96.1,42 v96.1,42.2
EN5V  (via drill 0.25)
  Top 0.254: U5.6 26.8,28.7 v26.8,29.2 | U28.27 115.29,39.49 v114,38.2
  Bottom 0.254: v26.8,29.2 31.3,29.2 41.2,39.1 65.5,39.1 66.1,38.5 74.3,38.5 77.5,35.3 97.8,35.3 100.2,32.9 107.7,32.9 113,38.2 v114,38.2
GND  (via drill 0.2, 0.3, 0.35)
  Top 0.15: U12.8 91.99,44.83 U9.3 91.99,42.71 v92.3,42.4 | U25.3 27.85,37.35 U25.15 | D12.10 10.39,16.12 D12.11
  Top 0.305: C33.2 84.22,49.98 U3.2
  Top 0.35: U26.2 41.48,14.09 v41.5,14.1 | U27.2 65.09,14.29 v65.2,14.4 | U29.2 95.27,14.4 v96.6,14.4 | U30.2 119.17,14.4 v120.4,14.4 | U31.2 151.62,14.29 v151.7,14.2 | U32.2 175.49,14.29 v175.5,14.3
  other vias: 182.1,41.5 179.2,41.5 179.2,42.8 182.1,42.8 29.3,37.5 28.5,37.5 27.7,37.5 29.3,36.7 28.5,36.7 27.7,36.7 29.3,35.9 28.5,35.9 27.7,35.9 28.9,35 28.1,35 23,34.3 24,34 23.8,35.4 24.8,36.3 47.8,34 41.8,31.8 38.9,33.5 47.4,31.9 51.7,33.6 51.3,32 56.1,34 43.5,33.6 25.1,6.6 30.8,29.9 24.1,8.4 23.3,11.8 30.8,28.2 26.8,10.8 75.5,31.2 75,33.6 24.6,10.6 97.8,47.6 89.9,53.1 89.7,49.9 1.4,38.5 77.9,33.7 93.5,52.6 94.7,45.6 29.5,30.2 57.5,31.4 66.5,31.9 62.7,31.5 67,34.6 55,31.5 59.8,33 63.3,33.8 70.1,30.9 73.9,32.2 1.7,42.8 70.5,33.8 10.9,52.9 31.9,28.7 2.4,46.2 7.4,50.4 2.9,37.1 3,40.2 4.8,42.7 4.5,34.3 1.3,36.3 22.5,7 2.7,34.5 0.9,34.5 108.5,31.3 98.4,31.2 101.3,31.3 178.4,32.1 174.6,31.7 171.7,33.2 175.2,34 182,31.1 110.9,33.1 182.4,34 154.4,33.7 154.9,31.3 152,31.2 163.4,33 167.2,33.4 170.1,31.9 166.6,31.1 159.8,34 156,32.7 159.4,31.1 134.2,33.9 134.7,31.5 131.8,31.4 143.2,33.2 147,33.6 149.9,32.1 146.4,31.3 139.6,34.2 135.8,32.9 139.2,31.3 129,31.6 128.5,34 131.4,34.1 120,32.3 116.2,31.9 113.3,33.4 116.8,34.2 123.6,31.3 127.4,32.6 124,34.2 93.7,30.7 93.2,33.1 96.1,33.2 84.7,31.4 80.9,31 78,32.5 81.5,33.3 88.3,30.4 92.1,31.7 88.7,33.3 128.9,46.7 127,48.7 127,45.5 130.3,50 132.6,52.3 126.3,52.4 157,47.8 113.3,43.9 103.7,51.2 64.3,42.8 65.5,36.3 63.6,50.9 123.3,41.9 65.5,52.4 63.1,46.3 102.6,47.8 178,44.6 123.2,52.4 64.9,48.3 74.2,53.3 66,45.4 66.9,42.5 86.5,44.7 72.1,46.6 94.9,44.2 148.4,48 173,51.8 150.7,45.8 112.1,46.7 148.4,50.7 150.6,51.2 150.6,38.1 186.6,52.9 149.9,42.6 95.4,40.1 115.5,40.5 148.9,40.6 112.4,50.6 105.9,39.8 104.3,45.7 98.4,45.9 120.3,41 91.5,41.6 91.5,40.8 92.3,40.8 92.3,41.6 90.7,42.4 91.5,42.4 90.7,40.8 90.7,41.6 1.4,22.4 1.4,23.8 2,20.6 3.5,21.9 3.5,19.7
  pour Top: 9.4,12.25 9.4,17.15 8.35,18.2 2.65,18.2 2.35,17.9 1.65,17.9 0.55,19 0.55,24.25 0.75,24.45 1.35,25.05 1.7,25.05 3.6,23.15 3.8,22.95 4.9,22.95 8.5,19.35 9.3,19.35 10.9,19.35 11.3,18.95 11.3,12.3 11.25,12.25
  pour Top: 5.25,27.5 3.5,29.25 3.5,29.7 3.3,29.9 0.25,29.9 0.05,30.1 0.05,54.9 0,54.95 5.1,54.95 8.3,51.75 8.3,33.85 7.8,33.35 7.8,31.55 7.7,31.45 4.15,31.45 3.55,30.85 3.55,30.25 3.9,29.9 4.6,29.9 4.9,29.6 6.75,29.6 7.2,29.15 7.2,27.5
  pour Top: 8.05,50 9,50.95 26.3,50.95 27.4,52.05 29,52.05 29.4,52.45 29.4,54.95 5,54.95 4.7,54.65 4.7,52.55 7.25,50
  pour Route2: 0.05,55.05 116.8,55.05 116.8,54.95 193.05,54.95 193.05,0 0.05,0
  pour Top: 27.5,30.9 27.5,33.9 27.7,34.1 27.7,35.5 27.7,36.6 27.2,37.1 27.1,37.2 25.7,37.2 25.7,37.5 27.2,37.5 27.7,38 27.7,39 27.7,39.9 27.4,40.2 27.4,41.1 29.6,41.1 29.6,40.2 29.4,40 29.2,39.8 29.2,38.1 29.8,37.5 29.9,37.5 34.5,37.5 34.7,37.3 34.7,35.3 34.2,34.8 33,34.8 32.8,35 32.8,35.5 32.5,35.8 32.2,35.8 30.3,35.8 29.7,35.8 29.3,35.4 29.3,34.1 29.5,33.9 29.7,33.7 29.7,33.2 29.7,30.9
  pour Top: 28.2,30.9 28.5,30.6 28.5,29.9 28.5,29 29.1,29 29.3,28.8 30.9,28.8 30.9,29.4 29.8,30.5 29.6,30.7 29.6,31 28.3,31
  pour Top: 21.1,5.7 21.1,22.9 22.3,24.1 22.3,34.7 25.1,37.5 25.8,37.5 25.8,37.2 25.5,37.2 25.4,37.1 25.4,35.2 24.8,34.6 24.8,25.8 25,25.6 25,24.4 25.6,23.8 27.9,23.8 28.2,24.1 28.2,26.1 28.3,26.2 28.3,27.2 28.8,27.7 30,27.7 30.2,27.9 30.2,30.1 30.4,30.3 31.8,30.3 33.9,28.2 33.9,25.1 29.5,20.7 29.5,9.1 26.1,5.7
  pour Top: 34.3,37.4 37.4,40.5 41.6,40.5 56,54.9 187.8,54.9 188.4,54.3 188.4,53.8 187.3,52.7 187.3,36 181.4,30.1 113.5,30.1 107,23.6 102.2,23.6 95.7,30.1 39.1,30.1 34.3,34.9
  pour Bottom: 178.4,43.7 183.1,43.7 183.1,40.8 178.4,40.8
  pour Bottom: 9.7,12.5 4.7,17.5 1.3,17.5 0.1,18.7 0.1,54.9 40.6,54.9 40.6,45.5 30.8,35.7 30.8,31.7 17.7,18.6 13.6,18.6 13.3,18.3 13.3,15.5 10.3,12.5
INT_RTC  (via drill 0.2)
  Top 0.15: U28.24 114.92,34.41 v114.8,34.3 | v183.2,49.2 183.51,49.52 U$1.17
  Bottom 0.15: v114.8,34.3 119.5,39 152.5,39 165.2,51.7 169.83,51.7 169.89,51.64 170.36,51.64 172.9,49.1 178.51,49.1 178.87,49.45 182.94,49.45 v183.2,49.2
LEDADDR  (via drill 0.2)
  Top 0.2: U28.33 117.11,46.52 116.61,46.52 115.9,45.81 v115.9,42.6 | v51,40.5 50,39.5 v50,38.4 | U26.3 39.34,15.1 v38.1,15.1 | v30,19.7 30,19.82 31.47,21.29 31.47,22.17 34.2,24.9 v34.2,30.7
  Bottom 0.2: v115.9,42.6 110.13,36.83 78.37,36.83 74.4,40.8 51.3,40.8 v51,40.5 | v50,38.4 49.9,38.5 42,38.5 v34.2,30.7 | v30,19.7 32,19.7 34.8,16.9 36.3,16.9 v38.1,15.1
N$1
  pour Top: 39.4,41.9 32.2,41.9 28.6,45.5 28.6,47 31.9,47 31.9,45.3 32.3,44.9 36.3,44.9 37.8,46.4 39.4,46.4 40.8,45 40.8,43.3
N$2
  Top 0.305: C5.1 4.9,30.39 5.1,30.2 6.05,30.2 U20.5
N$3
  Bottom 0.813: 20K1.1 39.8,21.39 N1.A
N$4
  Top 0.15: Q1.1 10.04,20.45 10.5,20.9 10.5,25.3 10.4,25.4 10.4,25.79 U20.1
  pour Top: 9.15,20.65 9.8,20.65 10.3,21.15 10.3,26.6 10.65,26.25 10.85,26.25 10.85,20.95 10.15,20.25 9.15,20.25
N$5
  pour Top: 9.75,21.5 7.3,21.5 5.1,23.7 5.1,26.6 7,26.6 7,25.2 7.7,24.5 9.75,24.5
  pour Top: 7,26.6 4.6,26.6 3,28.2 3,29.6 1.1,29.6 1.1,26.6 2.9,24.8 3.9,23.8 5.7,23.8 7,25.1
N$6
  Top 0.15: D12.1 13.54,21.37 Q1.5
  pour Top: 11.6,24.4 16.1,28.9 21.7,28.9 21.7,24.5 17.4,20.2 11.6,20.2
  pour Top: 11.9,17.9 11.9,19.9 11.6,20.2 14.4,20.2 15.1,20.2 13.9,19 13.9,18.7 13.9,17.9
N$7
  Top 0.406: 59.6,26.98 U18.17
  Top 0.61: N2.0 59.09,24.19 59.57,24.67 U18.17
N$8
  Top 0.406: 58.2,26.91 U18.16
  Top 0.61: U18.16 58.3,25 57.71,24.41 57.71,16.43 N2.9
N$9
  Bottom 0.813: 20K2.1 63.76,21.62 N2.A
N$10
  Top 0.813: R19.2 6.17,16.11 VR1.1 7.07,14.52 7.87,13.71 VR1.2
N$11  (via drill 0.2)
  Top 0.15: VR1.3 v3.41,12.81 v3.4,12.8 | v13,28.8 11.2,28.8 U20.3
  Top 0.813: VR1.3 7.21,10.17 R24.1 7.53,10.06 C7.2
  Route15 0.15: v3.4,12.8 3.4,18.4 8.1,23.1 8.1,25.6 11.5,29 12.8,29 v13,28.8
N$12
  Top 0.61: N2.8 56.7,15.16 56.7,25.1 57.03,25.43 U18.15
N$13
  Top 0.406: 55.8,26.97 U18.14
  Top 0.61: U18.14 55.76,13.74 58.22,11.28 N2.7
N$14
  Top 0.61: N1.5 42.3,9.9 42.6,9.6 44.6,9.6 53.2,18.2 53.2,26.99 U18.12
N$15
  Bottom 0.813: 20K.1 94.45,21.52 N3.A
N$16
  Top 0.61: N2.6 61.1,10.1 60.8,9.8 57.8,9.8 54.5,13.1 U18.13
N$17
  Top 0.152: U5.4 29.52,28.35 0.2
N$18
  Top 0.15: R5.2 78.2,52.4 D3.1
N$19
  Top 0.15: R7.2 81.41,53.49 D7.1
N$20
  Top 0.305: U5.2 27.8,27.4 27.6,27.6 26.45,27.6 L4.2
N$21
  Bottom 0.813: 20K4.1 118.36,21.34 N4.A
N$22
  Top 0.61: N2.1 67.87,20.73 66.1,22.5 63,22.5 60.84,24.66 U18.18
N$23
  Top 0.15: U9.8 88.91,43.19 88.4,43.7 87.89,43.7 R21.1 86.96,43.66 R17.2
N$24
  Top 0.15: R6.2 76.6,52.41 D2.1
N$25
  Top 0.35: D4.1 33.1,30.25 R10.2
N$26
  Top 0.254: 25.7,24.45 D5.1
  Top 0.35: R31.2 25.7,24.45
N$27
  Top 0.15: R13.2 79.8,52.42 D6.1
N$28
  Top 0.61: N2.2 69.4,16.53 69.4,24.5 70.25,25.35 U13.11
N$29
  Top 0.15: R20.2 96.25,43.14 98.35,43.14 U11.1
N$30
  Top 0.15: R9.2 95.97,41.34 96.58,41.95 97.22,41.95 U7.1
N$32
  Top 0.61: N1.6 37.2,9.9 36.9,9.6 35,9.6 31,13.6 31,19.8 32.18,20.98 32.18,21.88 35.06,24.76 36.3,24.76 36.75,25.21 U17.11
N$33
  Top 0.61: U17.12 38.02,25.02 36.85,23.85 35.43,23.85 33.09,21.5 33.09,20.6 31.91,19.42 31.91,13.99 34.82,11.08 N1.7
N$35
  Top 0.15: U9.9 87.92,42.69 R22.2
N$36
  Top 0.15: D10.1 R11.2
N$37
  Top 0.15: D11.1 97.2,37.65 R23.2
N$38
  pour Top: 24.8,43.5 24.8,47.9 28.2,51.3 31.9,51.3 32.2,51 32.2,49.8 31.9,49.5 30,49.5 27.7,47.2 27.7,43.6 27.1,43 25.3,43
N$39
  Top 0.61: U17.13 39.29,25 37.23,22.94 35.81,22.94 33.99,21.12 33.99,20.22 32.82,19.05 32.82,14.93 N1.8
N$40
  Top 0.61: N1.9 33.8,16.23 33.8,18.74 34.91,19.85 34.91,20.75 36.19,22.03 37.6,22.03 40.56,24.99 U17.14
N$41
  Top 0.61: U17.15 41.83,24.93 38.27,21.37 38.23,21.37 37.98,21.12 36.56,21.12 35.81,20.37 35.81,19.47 35.18,18.83 N1.0
N$42
  Top 0.61: U17.16 43.1,21.2 43.96,20.34 N1.1
N$43
  Top 0.61: U17.17 44.37,22.03 45.4,21 45.4,16.24 N1.2
N$44
  Top 0.61: U17.18 45.64,22.76 46.7,21.7 46.7,15.1 44.81,13.21 N1.3
N$45
  Top 0.61: N2.3 70.7,15.6 70.7,24.2 71.52,25.02 U13.12
N$46
  Top 0.61: N1.4 44.68,11.08 51.95,18.35 U18.11
N$47
  Top 0.61: N2.4 68.68,11.28 72,14.6 72,23.6 72.8,24.4 U13.13
N$48
  Top 0.61: N2.5 65.8,10.1 66.2,9.7 69,9.7 73.3,14 73.3,23.5 74.1,24.3 74.1,27.01 U13.14
N$49
  Top 0.61: N3.6 92.32,10.12 92,9.8 87.5,9.8 75.33,21.97 U13.15
N$50
  Top 0.61: U13.16 76.6,22.1 87.4,11.3 N3.7
N$51
  Top 0.61: N3.8 86.67,13.44 77.9,22.2 77.9,27.02 U13.17
N$52
  Top 0.61: U13.18 79.14,22.56 85.72,15.98 N3.9
N$53
  Top 0.61: N3.0 89.25,18.35 84.65,22.95 U14.11
N$54
  Top 0.61: U14.12 85.92,23.88 87.85,21.95 95.13,21.95 95.74,21.34 97.61,21.34 98.36,20.59 98.36,20.56 98.99,19.92 N3.1
N$55
  Top 0.61: U14.13 87.19,24.51 88.7,23 95.36,23 96.11,22.25 97.98,22.25 99.27,20.97 99.27,20.93 100.27,19.93 100.27,17.87 99.94,17.54 N3.2
N$56
  Top 0.61: U14.14 88.46,25.14 89.6,24 95.7,24 96.51,23.19 98.42,23.19 101.3,20.31 101.3,15.1 N3.3
N$57
  Top 0.61: N3.4 99.31,11.3 100.92,12.9 100.92,12.92 102.6,14.6 102.6,20.3 98.8,24.1 97,24.1 96.1,25 90.4,25 89.73,25.67 U14.15
N$58
  Top 0.61: U14.16 91,28.4 91.7,29.1 94.1,29.1 98.1,25.1 99.6,25.1 103.8,20.9 103.8,13.6 99.9,9.7 97.94,9.7 97.37,10.27 96.03,10.27 N3.5
N$59
  Top 0.254: U2.55 154.62,52.15 R4.2
N$60
  Top 0.61: N4.6 116.08,10.04 115.88,9.84 113.36,9.84 109.6,13.6 109.6,20.8 118.71,29.91 121.52,29.91 122.39,29.04 U16.11
N$61
  Top 0.61: U16.12 123.66,25.76 122.9,25 115.2,25 110.6,20.4 110.6,14.31 113.69,11.22 N4.7
N$62
  Top 0.61: N4.8 111.7,15.02 111.7,20.21 115.47,23.99 123.79,23.99 124.93,25.13 U16.13
N$63
  Top 0.61: U16.14 126.2,24.1 124.98,22.88 115.65,22.88 112.73,19.95 112.73,17.74 113.11,17.36 N4.9
N$64
  Top 0.61: N4.0 114.64,18.91 114.64,20.51 116.1,21.97 125.77,21.97 127.47,23.67 U16.15
N$65
  Top 0.61: N4.1 123.62,18.32 128.74,23.44 U16.16
N$66
  Top 0.61: U16.17 130.01,22.31 123.75,16.05 N4.2
N$67  (via drill 0.35, 0.4)
  Top 0.508: U17.10 35.48,28.88 v35.5,28.9 | U18.10 50.68,28.82 v50.6,28.9 | U13.10 68.98,28.98 v69,29 | U14.10 83.38,28.98 v83.4,29 | U16.10 121.12,28.88 v121.1,28.9 | U19.10 136.72,28.88 v136.7,28.9 | U4.10 156.52,28.88 v156.5,28.9 | U6.10 171.1,26.98 v171.1,28.9
  Top 0.61: 40K.2 110.75,29.36 v111.1,29
  Top 0.813: 40K.2 104.36,29.36 104.3,29.3 104.3,29.49 D1.C
  Bottom 0.61: v35.5,28.9 v50.6,28.9 68.9,28.9 v69,29 v83.4,29 v111.1,29 121,29 v121.1,28.9 v136.7,28.9 v156.5,28.9 v171.1,28.9
N$68
  Top 0.61: N4.3 131.28,21.2 U16.18
N$69
  Top 0.61: U19.11 137.99,25.19 124.02,11.22 N4.4
N$70
  Top 0.61: N4.5 120.96,10.04 121.2,9.8 124.4,9.8 139.26,24.66 U19.12
N$71
  Top 0.61: U19.17 145.61,18.67 N5.0
N$72
  Top 0.61: N5.9 143.7,16.7 143.7,19.2 144.34,19.84 U19.16
N$73
  Top 0.406: 143.1,26.93 U19.15
  Top 0.61: U19.15 143.07,20.17 142.5,19.6 142.5,15.1 144.14,13.46 N5.8
N$74
  Top 0.61: N5.7 144.48,11.32 141.4,14.4 141.4,20.5 141.8,20.9 U19.14
N$75
  Top 0.61: U19.13 140.53,21.33 140.1,20.9 140.1,13.5 143.3,10.3 144.8,10.3 145.4,9.7 147.98,9.7 N5.6
N$76
  Top 0.61: N5.1 154.09,20.11 152.1,22.1 148,22.1 146.88,23.22 U19.18
N$77
  Top 0.61: U4.11 157.8,24.7 155.59,22.49 155.59,16.54 N5.2
N$78
  Top 0.61: U4.12 159.06,24.26 156.8,22 156.8,15.52 N5.3
N$79
  Top 0.61: N5.4 154.62,11.32 158,14.7 158,21.4 160.33,23.73 U4.13
N$80
  Top 0.61: U4.14 161.6,23.2 159.3,20.9 159.3,13.9 154.9,9.5 152.7,9.5 152.06,10.14 N5.5
N$81
  Top 0.61: N6.6 172.28,10.1 171.2,10.1 170.7,9.6 167.7,9.6 162.87,14.43 U4.15
N$82
  Top 0.61: N6.7 167.58,11.32 164.14,14.76 U4.16
N$83
  Top 0.61: U4.17 165.41,15.49 167.44,13.46 N6.8
N$84
  Top 0.61: N6.9 166.68,17.62 U4.18
N$85
  Top 0.61: N6.0 169.21,21.01 172.39,24.19 U6.11
N$86
  Top 0.61: N6.1 177.99,20.21 173.66,24.54 U6.12
N$87
  Top 0.61: N6.2 178.94,17.14 179.5,17.7 179.5,20.4 174.93,24.97 U6.13
N$88
  Top 0.61: U6.14 176.2,25.4 180.6,21 180.6,15.42 N6.3
N$89
  Top 0.61: N6.4 177.74,11.9 179.3,11.9 181.9,14.5 181.9,21.31 177.47,25.74 U6.15
N$90
  Top 0.61: U6.16 178.74,25.96 183.1,21.6 183.1,12.8 180.1,9.8 176.5,9.8 176.1,10.2 174.94,10.2 N6.5
N$91
  Top 0.15: U25.9 31.98,35.4 R16.1 R14.1
N$92
  Bottom 0.813: 20K5.1 149.75,21.45 N5.A
N$93
  Bottom 0.813: 20K3.1 173.56,21.43 N6.A
N$94
  Top 0.254: U1.56 69.11,53.01 69.8,53.7 R1.1
N$95
  Top 0.254: U1.55 69.98,52.51 R12.2
N$96  (via drill 0.2, 0.3)
  Top 0.254: U$1.19 186.62,52.05 R32.1
  Top 0.305: U$1.19 182.25,52.05 v179.1,48.9 | R32.1 187.02,51.65 187.14,51.65 187.45,51.35 187.45,50.71 190.9,47.26 v190.9,42.9
  Bottom 0.305: U$2.P$2 176.55,48.5 178.7,48.5 v179.1,48.9 | U$2.P$1 190.9,42.55 v190.9,42.9
N$97
  Top 0.254: U2.56 153.75,52.65 154.3,53.2 R8.1
N$100  (via drill 0.2)
  Top 0.2: U26.1 39.05,13.15 v39,13.1 | U27.3 64.05,15.75 v63.5,15.2
  Bottom 0.2: v39,13.1 43.2,13.1 44.16,12.14 58.69,12.14 59.65,13.1 61.4,13.1 v63.5,15.2
N$101  (via drill 0.2)
  Top 0.2: U27.1 62.95,13.25 v62.9,13.2 | v94.6,15.1 95.15,15.65 U29.3
  Bottom 0.2: v62.9,13.2 67.21,13.2 68.07,12.34 90.34,12.34 93.1,15.1 v94.6,15.1
N$102  (via drill 0.2)
  Top 0.2: U29.1 94.05,13.25 v94,13.2 | v118.4,15.2 118.95,15.75 U30.3
  Bottom 0.2: v118.4,15.2 116.4,13.2 114.73,13.2 113.81,12.28 99.27,12.28 98.35,13.2 v94,13.2
N$103  (via drill 0.2)
  Top 0.2: U30.1 117.85,13.05 v117.8,13 | v149.7,15.2 150.25,15.75 U31.3
  Bottom 0.2: v149.7,15.2 147.5,13 145.73,13 145.01,12.28 122.99,12.28 122.27,13 v117.8,13
N$104  (via drill 0.2)
  Top 0.2: U31.1 149.15,13.35 v149.1,13.3 | v173.6,15.1 173.6,15.56 U32.3
  Bottom 0.2: v173.6,15.1 171.8,13.3 169.93,13.3 169.01,12.38 154.29,12.38 153.37,13.3 v149.1,13.3
N$199
  Top 0.254: U$1.18 183.19,50.78 180.65,48.24 U$1.5
NEN170V  (via drill 0.25)
  Top 0.254: U20.4 12.23,30.23 v12.8,30.8 | v115.4,38.3 117.62,38.3 U28.26
  Bottom 0.254: v12.8,30.8 12.8,38.7 13.9,39.8 66,39.8 66.7,39.1 74.6,39.1 77.9,35.8 98.1,35.8 100.5,33.4 107.59,33.4 113.09,38.9 114.8,38.9 v115.4,38.3
OE0  (via drill 0.2)
  Top 0.15: U28.14 100.05,36.3 v98.9,36.3 | v67.2,40.1 68.45,40.1 U1.30
  Bottom 0.15: v98.9,36.3 78.2,36.3 74.4,40.1 v67.2,40.1
OE1  (via drill 0.2)
  Top 0.15: U2.30 151.85,39.65 v151.8,39.6 | v104.9,34.1 104.75,34.24 U28.16
  Bottom 0.15: v104.9,34.1 107.83,34.1 113.33,39.6 146.65,39.6 146.78,39.47 147.22,39.47 147.35,39.6 v151.8,39.6
OPRLED  (via drill 0.2)
  Top 0.15: R7.1 82.15,51.45 v82.3,51.3 | v116.1,52.2 U28.37
  Bottom 0.15: v82.3,51.3 83.1,50.5 97.1,50.5 98.8,52.2 v116.1,52.2
PWRLED  (via drill 0.2)
  Top 0.15: R6.1 76.66,51.5 v77.4,51.5 | v102.5,40.6 102.34,40.76 U28.11
  Bottom 0.15: v77.4,51.5 77.4,48.2 87.3,38.3 96.9,38.3 99.12,40.52 102.11,40.52 102.29,40.7 102.4,40.7 v102.5,40.6
RST  (via drill 0.2)
  Top 0.15: U11.3 96.7,43.89 v96.7,44.2 | v98.9,50.8 99.02,50.92 100.3,50.92 U28.3 102.18,50.92 v102.5,50.6 | C25.1 121.9,51.04 | 121.9,51.04 121.89,51.04 R15.1 | 121.9,51.04 121.9,51.85 RESET.2 v119.4,51.51 v119.4,51.5
  Bottom 0.15: v96.7,44.2 96.7,48.6 v98.9,50.8 | v119.4,51.5 104.9,51.5 104,50.6 v102.5,50.6
RTS  (via drill 0.2)
  Top 0.15: U9.24 94.97,41.19 R9.1 95.12,41.52 v95.4,41.8 | U11.2 98.18,44.11 v97.72,43.65
  Bottom 0.15: v97.72,43.65 96.78,42.7 95.89,42.7 95.5,42.31 95.5,41.9 v95.4,41.8
RXD  (via drill 0.2)
  Top 0.15: U9.26 94.08,42.19 94.47,42.58 v94.9,42.58 | v115.9,48.1 117.42,48.1 U28.34
  Bottom 0.15: v94.9,42.58 94.84,42.53 94.41,42.53 94.05,42.16 94.05,41.54 94.34,41.24 94.66,41.24 94.98,40.92 96.07,40.92 96.5,40.49 97.15,40.49 97.61,40.95 97.61,41.11 99.29,42.8 110.6,42.8 v115.9,48.1
RXD_LED
  Top 0.15: U9.18 91.49,38.81 92.65,37.65 D11.2
SCL  (via drill 0.2)
  Top 0.15: U28.30 120.03,43.3 R3.1 120.64,43.23 v121,43.6 121.3,43.6 121.6,43.9 121.6,47.28 U10.6 | v142.7,52.14 U2.2 | v62.6,52.4 62.3,52.4 62.19,52.51 U1.2 | U$1.1 171.28,53.33 v170.1,52.14
  Bottom 0.15: v62.6,52.4 63.93,52.4 79,37.33 109.83,37.33 116.1,43.6 v121,43.6 127.8,43.6 136.34,52.14 v142.7,52.14 v170.1,52.14
SDA  (via drill 0.2)
  Top 0.15: U28.31 119.97,44.57 R2.1 120.8,44.7 v121,44.5 | U2.1 v142.17,52.65 | U1.1 v63.89,53.01 v63.9,53 | v173.6,49.7 173.78,49.52 U$1.4 | U10.1 124.13,45.33 v123.3,44.5
  Bottom 0.15: v63.9,53 79.1,37.8 109.5,37.8 116.2,44.5 v121,44.5 v123.3,44.5 128.1,44.5 136.25,52.65 v142.17,52.65 170.65,52.65 v173.6,49.7
TXD  (via drill 0.2)
  Top 0.15: U9.25 94.19,41.69 94.35,41.85 v94.65,41.85 | U28.35 116.45,49.65 115.17,48.37 v115.17,48.1
  Bottom 0.15: v115.17,48.1 110.27,43.2 99.3,43.2 97.33,41.23 97.33,41.07 97.03,40.77 96.61,40.77 96.19,41.2 95.1,41.2 94.65,41.65 v94.65,41.85
TXD_LED
  Top 0.15: D10.2 94.56,38.3 92.6,38.3 91.99,38.91 U9.19
VBUS
  Top 0.2: R21.2 87.86,45.94 87.8,46
  Top 0.305: U3.1 85.12,48.98 | 85.12,48.98 85.9,48.2 85.9,46.9 86.8,46 87.8,46 88.6,46 88.75,46.15 J1.B4A9 88.75,47.92 90.13,49.3 92.2,49.3 93.65,47.85 J1.A4B9 93.65,46.47 U12.1 U12.10 | C33.1 83.22,51.09 U3.3 83.22,49.08 83.5,48.8 84.94,48.8 85.12,48.98
VCC
  pour Top: 11.9,27.4 8.6,27.4 7.9,28.1 7.9,30.8 8.2,31.1 8.7,31.6 8.7,31.8 8.8,31.9 9.8,31.9 9.8,28.2 10.1,27.9 11.9,27.9
  pour Top: 8.7,31.6 8.7,33.3 8.9,33.5 8.9,49.2 9.8,50.1 22,50.1 23.3,48.8 23.9,48.2 23.9,46.9 23.9,43.5 25.6,41.8 25.8,41.6 26.6,41.6 26.6,40.3 27.2,39.7 27.2,38.7 27.2,38.5 26.7,38.5 26.5,38.3 26.5,37.9 24.8,37.9 23.7,36.8 18.5,31.6
  pour Top: 24.8,42.6 30.5,42.6 30.7,42.4 31.3,41.8 31.3,38.6 29.9,38.6 29.9,39.7 30.1,39.9 30.1,41.4 29.9,41.6 26.4,41.6 26.3,41.5 25.9,41.5
VDD  (via drill 0.2, 0.25, 0.3)
  Top 0.15: R15.2 120.26,51.06 v120.2,51 | R2.2 v120.11,46.39 v120.1,46.4 | R3.2 120.72,42.38 v120.8,42.3 | U9.6 U9.7 89.55,44.4 v89.1,44.4 | R23.1 98.06,37.87 v98.6,38.4 98.6,38.52 R11.1
  Top 0.254: U2.18 146.95,44.15 v147,44.1 | U2.27 146.65,39.65 v147,40 | C11.1 154.69,47.65 U2.46 151.65,47.65 v151.6,47.7 | R4.1 R8.2 155.62,53.98 v155.6,54 | U$1.20 185.85,53.33 C34.1 185.85,54.15 v185.7,54.3 | R12.1 R1.2 72,53.7 v72.1,53.6 | U1.18 v62.49,44.51 v62.5,44.5 | v66.5,48 v66.51,48.01 U1.46 70.02,48.01 C8.1
  Top 0.305: U3.5 85.12,45.95 C32.1 85.1,45.88 v85.1,45 | R22.1 86.16,42.74 v86.1,42.8 | U28.2 99.51,52.19 99.3,52.4 98.62,52.4 C30.1 97.52,52.38 v97.5,52.4 | U10.5 120.25,48.48 C31.1 120.1,48.52 v120.1,49.2
  Top 0.35: R10.1 33.09,31.69 33.2,31.8 33.1,31.9 v32.5,31.9
  other vias: 25.9,29.6 26.3,30.3 25.5,30.3 33.7,32.7 32.9,32.6 32.1,32.6 31.9,31.3
  pour Top: 25.5,28.1 25.2,28.1 25.2,34.4 25.6,34.8 27.1,34.8 27.1,33.7 26.8,33.4 26.8,30.9 27.3,30.4 27.4,30.3 27.9,30.3 27.9,28.2 26.4,28.2 26.3,28.1
  pour Top: 29.8,34.8 31.3,34.8 31.3,34 31.6,33.7 32.4,33.7 32.7,33.7 32.8,33.8 32.9,33.9 32.9,34.1 32.9,34.2 33.9,34.2 34.5,33.6 34.5,32.6 32.7,30.8 30.5,30.8 30.4,30.9 30.4,33.7 30,34.1 29.8,34.3
  pour Route15: 59.5,39.2 59.5,46.3 187.3,46.3 187.3,42 183,37.7 61,37.7
  pour Route15: 25.2,28.1 25.2,34.4 25.6,34.8 34.7,34.8 54.5,54.6 62.8,54.6 62.8,37.9 62.6,37.7 60.7,37.7 53.9,30.9 30.5,30.9 27.7,28.1
  pour Route15: 59.5,46.3 59.5,53.4 60.7,54.6 84.7,54.6 85.3,54 85.3,46.2 85.1,46 59.8,46
  pour Route15: 97.4,46 97.4,53.9 97.9,54.4 185.9,54.4 187.2,53.1 187.2,45.9 186.7,45.4 98,45.4

## Text on the board
tPlace: FL | PWR | DEV | COMMS | OPRS | 3V3 | 5V